# Altium schematic sheet Temperature Sensors.SchDoc: Temperature Sensors
size Letter; Author: Leonardo Marquez; DrawnBy: Leonardo Marquez; Organization: Open Reflow Oven; Address1: leonardomarquez.com; Address2: github.com/marqueztronics; DocumentNumber: 001; Revision: A02; SheetNumber: 5; SheetTotal: 5
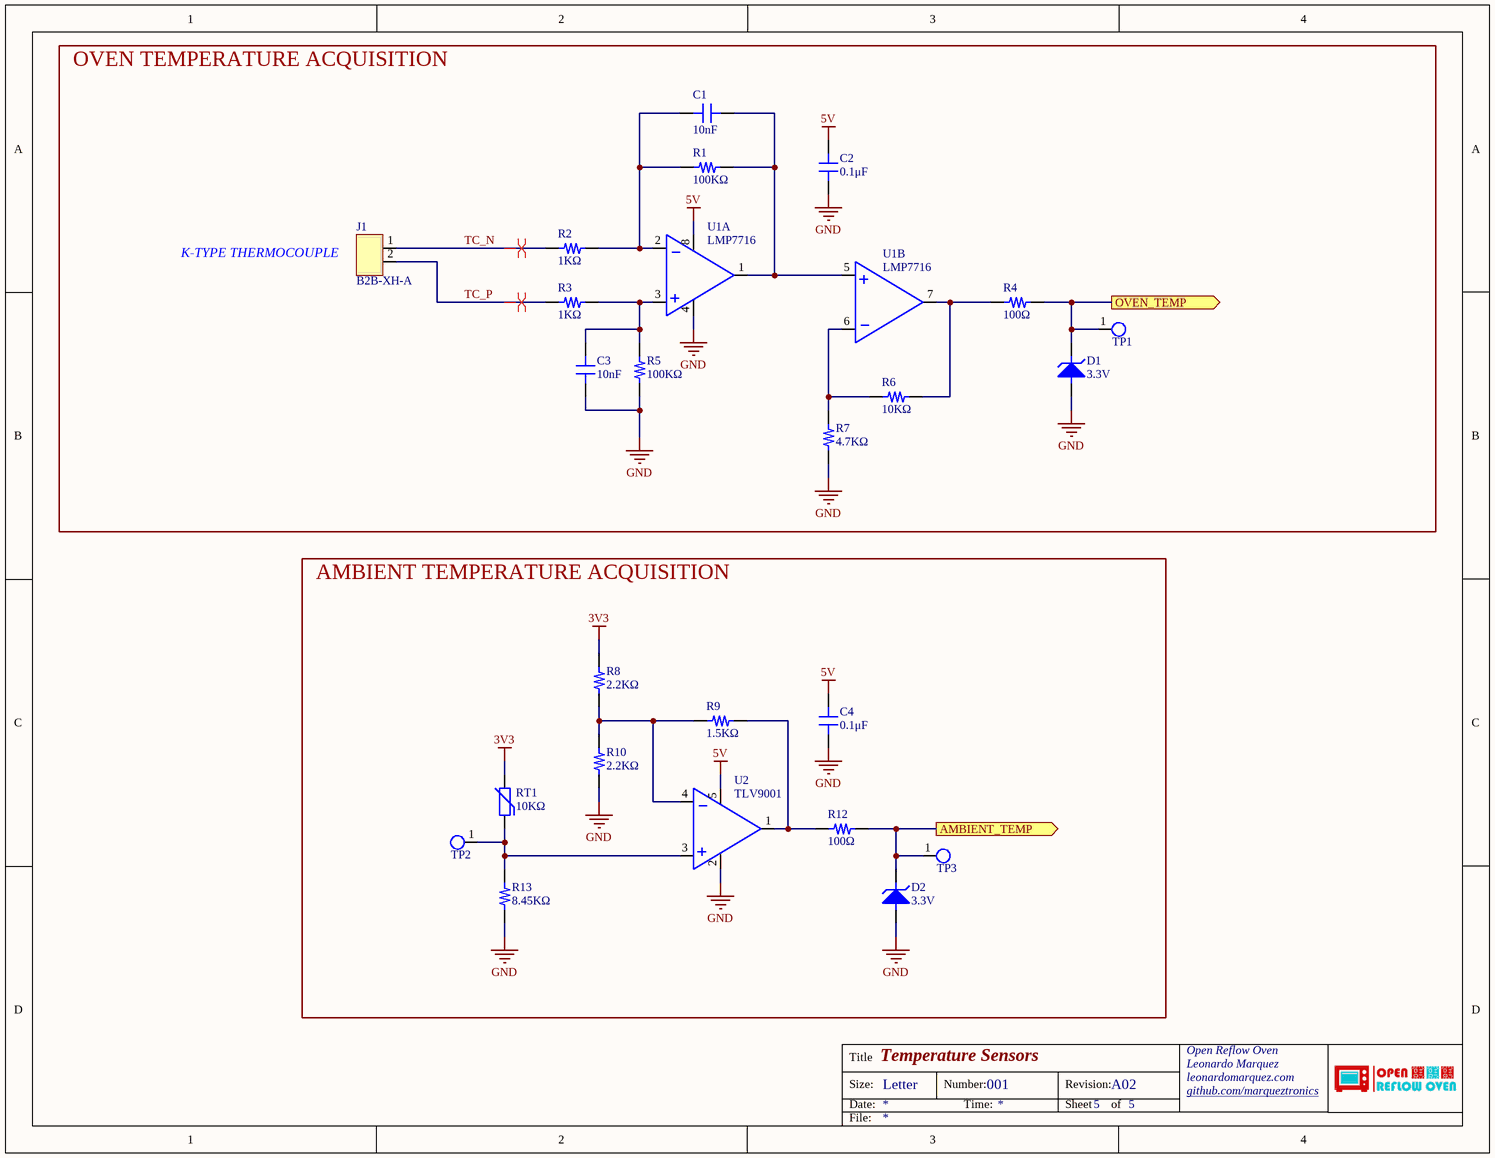
[diagram p0: Temperature Sensors.SchDoc]

## Parts
C1  10nF  [C0603]
C2  0.1μF  [C0603]
C3  10nF  [C0603]
C4  0.1μF  [C0603]
D1  3.3V  [SOD-323]
D2  3.3V  [SOD-323]
J1  B2B-XH-A  [B2B-XH-A]
R1  100KΩ  [R0603]
R2  1KΩ  [R0603]
R3  1KΩ  [R0603]
R4  100Ω  [R0603]
R5  100KΩ  [R0603]
R6  10KΩ  [R0603]
R7  4.7KΩ  [R0603]
R8  2.2KΩ  [R0603]
R9  1.5KΩ  [R0603]
R10  2.2KΩ  [R0603]
R12  100Ω  [R0603]
R13  8.45KΩ  [R0603]
RT1  10KΩ  [RT0603]
TP1  TP-1MM-ROUND  [TP-1MM-ROUND]  (value not drawn)  (no BOM)
TP2  TP-1MM-ROUND  [TP-1MM-ROUND]  (value not drawn)  (no BOM)
TP3  TP-1MM-ROUND  [TP-1MM-ROUND]  (value not drawn)  (no BOM)
U1  LMP7716  [VSSOP-8]  (parts A,B of 2)
U2  TLV9001  [SOT-23-5]

## Blocks framed on the sheet
OVEN TEMPERATURE ACQUISITION: C1-C3 D1 J1 R1-R7 TP1 U1
AMBIENT TEMPERATURE ACQUISITION: C4 D2 R8-R10 R12 R13 RT1 TP2 TP3 U2

## Ports
AMBIENT_TEMP (out), OVEN_TEMP (out)

## Nets
3V3: R8.2 RT1.2
5V: C2.2 C4.2 U1.8(V+) U2.5(V+)
GND: C2.1 C3.1 C4.1 D1.A D2.A R5.1 R7.1 R10.1 R13.1 U1.4(V-) U2.2(V-)
AMBIENT_TEMP: D2.K R12.2 TP3.1 ; port AMBIENT_TEMP
OVEN_TEMP: D1.K R4.2 TP1.1 ; port OVEN_TEMP
TC_N: J1.1 R2.1
TC_P: J1.2 R3.1
NetC1_1: C1.1 R1.2 R2.2 U1.2(-IN_A)
NetC1_2: C1.2 R1.1 U1.1(OUT_A) U1.5(+IN_B)
NetC3_2: C3.2 R3.2 R5.2 U1.3(+IN_A)
NetR4_1: R4.1 R6.2 U1.7(OUT_B)
NetR6_1: R6.1 R7.2 U1.6(-IN_B)
NetR8_1: R8.1 R9.1 R10.2 U2.4(IN-)
NetR9_2: R9.2 R12.1 U2.1(OUT)
NetR13_2: R13.2 RT1.1 TP2.1 U2.3(IN+)

## Layout directives
differential pair: TC_N, TC_P

## Notes on the sheet
- K-TYPE THERMOCOUPLE
- Title
- Size:
- Date:
- Letter
- Number:
- Time:
- Revision:
- Sheet
- of
- File:

## Library data of the parts
C1 C3 = C-10NF-50V-X7R-C0603: 50V 10nF X7R ±10% 0603 Multilayer Ceramic Capacitors MLCC - SMD/SMT ROHS; Manufacturer: Samsung Electro-Mechanics; Manufacturer Part Number: CL10B103KB8NNNC; Price Unit: 0.0028; Price 1K: 0.0022; Supplier 1: LCSC; Supplier Part Number 1: C1589
C2 C4 = C-0.1UF-50V-X7R-C0603: 50V 100nF X7R ±10% 0603 Multilayer Ceramic Capacitors MLCC - SMD/SMT ROHS; Manufacturer: Samsung Electro-Mechanics; Manufacturer Part Number: CL10B104KB8NNNC; Price Unit: 0.0024; Price 1K: 0.0019; Supplier 1: LCSC; Supplier Part Number 1: C1591
D1 D2 = D-ZENER-3.3V-SOD-323: Single 3.32V~3.53V 400mW 3.3V SOD-323 Zener Diodes ROHS; Manufacturer: Nexperia; Manufacturer Part Number: PDZ3.3B,115; Price Unit: 0.0192; Price 1K: 0.013; Supplier 1: LCSC; Supplier Part Number 1: C426855
J1 = J-2P-2.5MM-B2B-XH-A: 1x2P 2P XH 1 2.5mm 2 Brass Plugin,P=2.5mm Wire To Board Connector ROHS; Manufacturer: JST; Manufacturer Part Number: B2B-XH-A(LF)(SN); Price Unit: 0.0301; Price 1K: 0.0208; Supplier 1: LCSC; Supplier Part Number 1: C158012
R1 R5 = R-100K-1/10W-R0603: 100mW Thick Film Resistors 75V ±100ppm/℃ ±1% 100kΩ 0603 Chip Resistor - Surface Mount ROHS; Manufacturer: Yageo; Manufacturer Part Number: RC0603FR-07100KL; Price Unit: 0.0009; Price 1K: 0.0007; Supplier 1: LCSC; Supplier Part Number 1: C14675
R2 R3 = R-1K-1/10W-R0603: 100mW Thick Film Resistors 75V ±100ppm/℃ ±1% 1kΩ 0603 Chip Resistor - Surface Mount ROHS; Manufacturer: Yageo; Manufacturer Part Number: RC0603FR-071KL; Price Unit: 0.001; Price 1K: 0.0008; Supplier 1: LCSC; Supplier Part Number 1: C22548
R4 R12 = R-100-1/10W-R0603: 100mW Thick Film Resistors 75V ±100ppm/℃ ±1% 100Ω 0603 Chip Resistor - Surface Mount ROHS; Manufacturer: Yageo; Manufacturer Part Number: RC0603FR-07100RL; Price Unit: 0.001; Price 1K: 0.0007; Supplier 1: LCSC; Supplier Part Number 1: C105588
R6 = R-10K-1/10W-R0603: 100mW Thick Film Resistors 75V ±100ppm/℃ ±1% 10kΩ 0603 Chip Resistor - Surface Mount ROHS; Manufacturer: Yageo; Manufacturer Part Number: RC0603FR-0710KL; Price Unit: 0.0009; Price 1K: 0.0007; Supplier 1: LCSC; Supplier Part Number 1: C98220
R7 = R-4.7K-1/10W-R0603: 100mW Thick Film Resistors 75V ±100ppm/℃ ±1% 4.7kΩ 0603 Chip Resistor - Surface Mount ROHS; Manufacturer: Yageo; Manufacturer Part Number: RC0603FR-074K7L; Price Unit: 0.001; Price 1K: 0.0008; Supplier 1: LCSC; Supplier Part Number 1: C99782
R8 R10 = R-2.2K-1/10W-R0603: 100mW Thick Film Resistors 75V ±100ppm/℃ ±1% 2.2kΩ 0603 Chip Resistor - Surface Mount ROHS; Manufacturer: Yageo; Manufacturer Part Number: RC0603FR-072K2L; Price Unit: 0.0011; Price 1K: 0.0009; Supplier 1: LCSC; Supplier Part Number 1: C114662
R9 = R-1.5K-1/10W-R0603: 100mW Thick Film Resistors 75V ±100ppm/℃ ±1% 1.5kΩ 0603 Chip Resistor - Surface Mount ROHS; Manufacturer: Yageo; Manufacturer Part Number: RC0603FR-071K5L; Price Unit: 0.0012; Price 1K: 0.0009; Supplier 1: LCSC; Supplier Part Number 1: C114668
R13 = R-8.45K-1/10W-R0603: 100mW Thick Film Resistors 75V ±100ppm/℃ ±1% 8.45kΩ 0603 Chip Resistor - Surface Mount ROHS; Manufacturer: Yageo; Manufacturer Part Number: RC0603FR-078K45L; Price Unit: 0.0012; Price 1K: 0.001; Supplier 1: LCSC; Supplier Part Number 1: C163417
RT1 = RT-10K-NTC-RT0603: 10kΩ 330uA 100mW ±1% 3950K ±1% 0603 NTC Thermistors ROHS; Manufacturer: Sunlord; Manufacturer Part Number: SDNT1608X103F3950FTF; Price Unit: 0.0206; Price 1K: 0.0148; Supplier 1: LCSC; Supplier Part Number 1: C279936
TP1-TP3 = TP-1MM-ROUND: Round Test Point 1mm Dia
U1 = U-LMP7716MM/NOPB-VSSOP-8: 17MHz 0.1pA Dual VSSOP-8 Precision OpAmps ROHS; Manufacturer: Texas Instruments; Manufacturer Part Number: LMP7716MM/NOPB; Price Unit: 2.1951; Price 1K: 1.3767; Supplier 1: LCSC; Supplier Part Number 1: C72531
U2 = U-TLV9001IDBVR-SOT-23-5: 5pA Single 1MHz SOT-23-5 Operational Amplifier ROHS; Manufacturer: Texas Instruments; Manufacturer Part Number: TLV9001IDBVR; Price Unit: 0.2141; Price 1K: 0.136; Supplier 1: LCSC; Supplier Part Number 1: C398363